# Altium schematic sheet Microcontroller.SchDoc
size A4; SheetNumber: 5; SheetTotal: 5
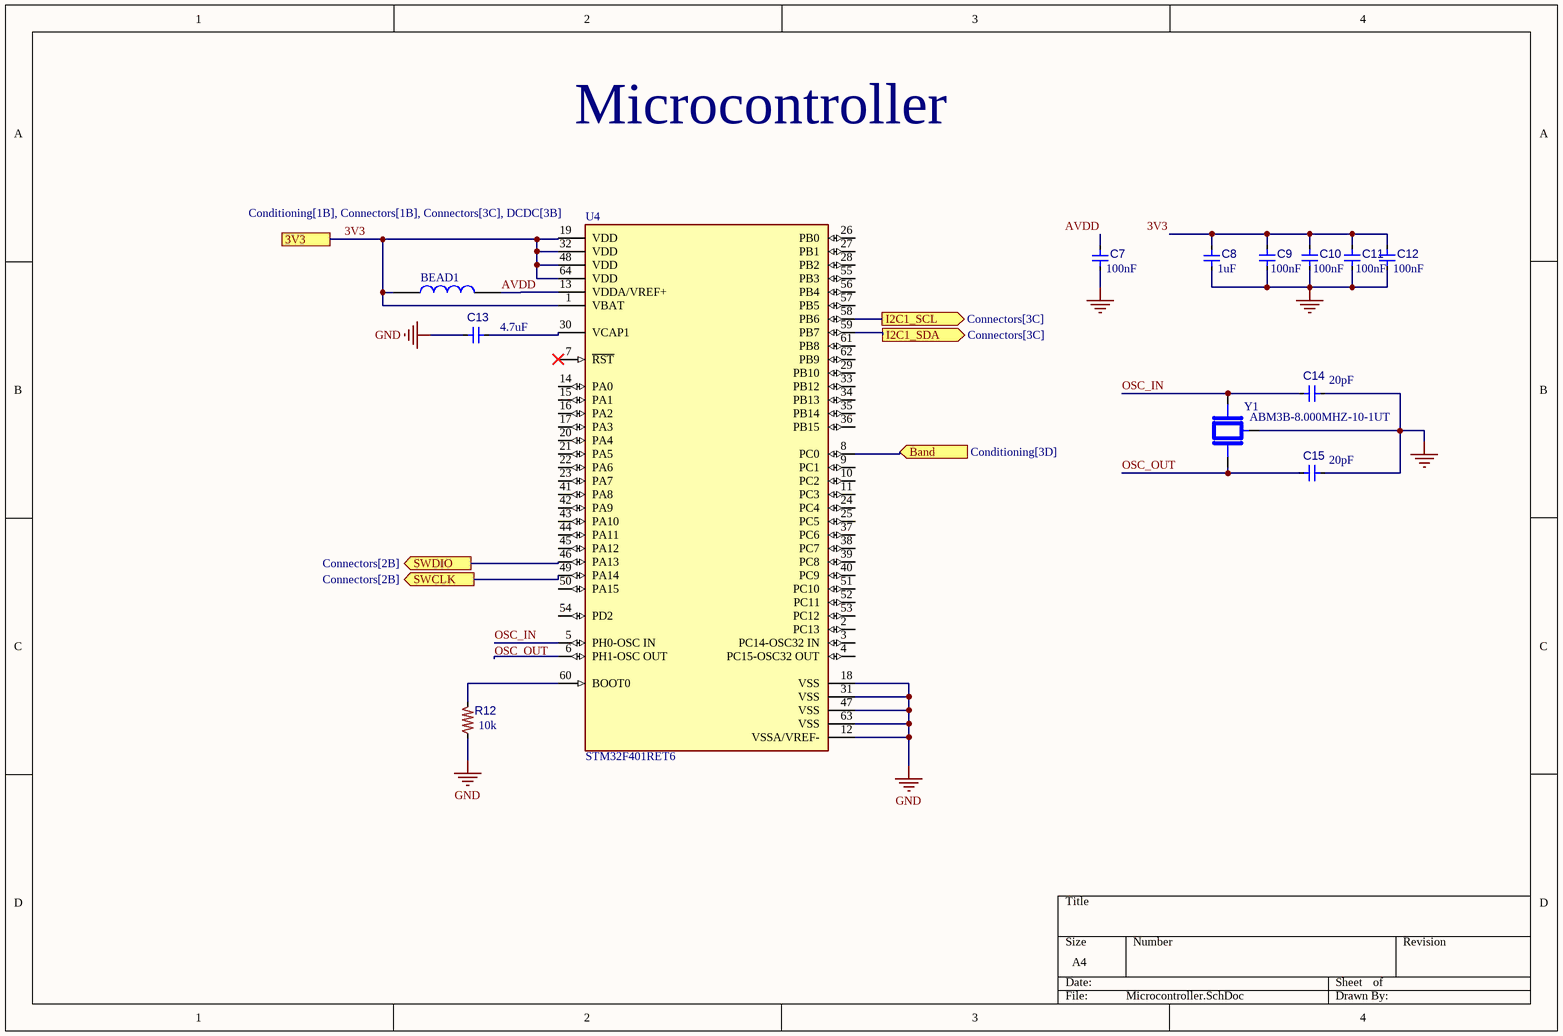
[diagram p0: Microcontroller.SchDoc]

## Parts
BEAD1  C710390  [BEADC1608X95N]  (value not drawn)
C7  C105907  [New footprint 1]  (value not drawn)
C8  C309479  [New footprint 1]  (value not drawn)
C9  C105907  [New footprint 1]  (value not drawn)
C10  C105907  [New footprint 1]  (value not drawn)
C11  C105907  [New footprint 1]  (value not drawn)
C12  C105907  [New footprint 1]  (value not drawn)
C13  C77045  [New footprint 1]  (value not drawn)
C14  C63680  [New footprint 1]  (value not drawn)
C15  C63680  [New footprint 1]  (value not drawn)
R12  C103210  [0603 resistor-Footprint-1]  (value not drawn)
U4  STM32F401RET6  [FP-LQFP64-5W-MFG]
Y1  ABM3B-8.000MHZ-10-1UT  [XTAL_ABM3B-8.000MHZ-10-1UT]

## Ports
3V3 (see Conditioning[1B], Connectors[1B], Connectors[3C], DCDC[3B]), Band (in, see Conditioning[3D]), I2C1_SCL (out, see Connectors[3C]), I2C1_SDA (out, see Connectors[3C]), SWCLK (out, see Connectors[2B]), SWDIO (out, see Connectors[2B])

## Nets
GND: C7.1 C8.1 C9.1 C10.1 C13.1 C14.2 C15.2 R12.2 U4.12(VSSA/VREF-) U4.18(VSS) U4.31(VSS) U4.47(VSS) U4.63(VSS) Y1.4
3V3: BEAD1.1 C8.2 C9.2 C10.2 C11.2 C12.2 U4.1(VBAT) U4.19(VDD) U4.32(VDD) U4.48(VDD) U4.64(VDD) ; port 3V3
AVDD: BEAD1.2 C7.2 U4.13(VDDA/VREF+)
Band: U4.8(PC0) ; port Band
I2C1_SCL: U4.58(PB6) ; port I2C1_SCL
I2C1_SDA: U4.59(PB7) ; port I2C1_SDA
OSC_IN: C14.1 U4.5(PH0-OSC_IN) Y1.3
OSC_OUT: C15.1 U4.6(PH1-OSC_OUT) Y1.1
SWCLK: U4.49(PA14) ; port SWCLK
SWDIO: U4.46(PA13) ; port SWDIO
NetC11_1: C11.1 C12.1
NetC13_2: C13.2 U4.30(VCAP1)
NetR12_1: R12.1 U4.60(BOOT0)

Not connected (* = marked no-connect by the designer): U4 2(PC13) 3(PC14-OSC32_IN) 4(PC15-OSC32_OUT) 7(~{RST})* 9(PC1) 10(PC2) 11(PC3) 14(PA0) 15(PA1) 16(PA2) 17(PA3) 20(PA4) 21(PA5) 22(PA6) 23(PA7) 24(PC4) 25(PC5) 26(PB0) 27(PB1) 28(PB2) 29(PB10) 33(PB12) 34(PB13) 35(PB14) 36(PB15) 37(PC6) 38(PC7) 39(PC8) 40(PC9) 41(PA8) 42(PA9) 43(PA10) 44(PA11) 45(PA12) 50(PA15) 51(PC10) 52(PC11) 53(PC12) 54(PD2) 55(PB3) 56(PB4) 57(PB5) 61(PB8) 62(PB9)

## Notes on the sheet
- Microcontroller
- (near C7) 100nF
- (near C8) 1uF
- (near C9) 100nF
- (near C10) 100nF
- 100nF
- (near C12) 100nF
- (near C13) 4.7uF
- (near C14) 20pF
- (near C15) 20pF
- (near R12) 10k

## Library data of the parts
BEAD1 = CMP-038-000000-3: MURATA Ferrite Beads 120 OHM - BLM18SG121TZ1D; Manufacturer_Name: Walsin Technology Corporation; Geometry.Height: 0.95mm; Mouser Price/Stock: https://www.mouser.co.uk/ProductDetail/Walsin/WLBD1608K1U601TB/?qs=ZrPdAQfJ6DPLMgkQk27DNg%3D%3D; Mouser Part Number: 791-WLBD1608K1U601TB; Design Item ID: WLBD1608K1U601TB; Datasheet Link: https://www.mouser.fr/datasheet/2/210/kamaya_watc-s-a0003407801-1-1749693.pdf; Source: WLBD1608K1U601TB.SchLib; Manufacturer_Part_Number: WLBD1608K1U601TB
C7 C9-C12 = CMP-001-00083-1: 100V 100nF X7R ±10% 0603  Multilayer Ceramic Capacitors MLCC - SMD/SMT ROHS
C8 = CMP-001-00083-1: 6.3V 1uF X7R ±10% 0603  Multilayer Ceramic Capacitors MLCC - SMD/SMT ROHS
C13 = CMP-001-00083-1: 116V 4.7uF X5R ±10% 0603 Multilayer Ceramic Capacitors MLCC - SMD/SMT ROHS
C14 C15 = CMP-001-00083-1: 200V 20pF C0G ±5% 0603 Multilayer Ceramic Capacitors MLCC - SMD/SMT ROHS
R12 = CMP-009-00177-1: 100mW Thick Film Resistors ±100ppm/℃ ±5% 10kΩ 0603 Chip Resistor - Surface Mount ROHS
U4 = CMP-12105-000004-1: 512KB 1.7V~3.6V ARM Cortex-M4 84MHz 50 LQFP-64(10x10)  Microcontroller Units (MCUs/MPUs/SOCs) ROHS; Manufacturer: STMicroelectronics; Memory Size: 512KBytes; Number Of Cores: 1; Max Junction Temp: +105°C; Ram Size: 96KBytes; Number Of Adc Channels: 12; Number Of Pwm Channels: 23; Standoff Height: 0.05mm; Number Of Timers/Counters: 8; Number Of I/Os: 50; Interface: I2C,SPI,USART,USB,IrDA,I2S,SMBus,Other; Number Of I2C Channels: 3; Max Supply Voltage: 3.6V; Data Bus Width: 32bits; Min Supply Voltage: 1.65V; Memory Type: FLASH; Category: IC; Device Class L3: Microcontrollers; ComponentLink2URL: https://www.st.com/resource/en/datasheet/stm32f401re.pdf; RoHS: TRUE; Temperature Range High: +105°C; Device Class L2: Embedded Processors and Controllers; ComponentLink2Description: Datasheet; Temperature Range Low: -40°C; Digikey Description: IC MCU 32BIT 512KB FLASH 64LQFP; Package: LQFP64-5W; Manufacturer Part Number: STM32F401RET6; Number Of A/D Converters: 1; Frequency: 84MHz; Ipc Land Pattern Name: QFP50P1200X1200X160-64; Automotive: No; Ambient Temperature Range Low: -40°C; Height: 1.6mm; Octopart: https://octopart.com/stm32f401ret6-stmicroelectronics-34185993; Ambient Temperature Range High: +85°C; Device Class L1: Integrated Circuits (ICs); Temperature: -40°C to +105°C; Core Architecture: ARM Cortex-M4; Number Of Spi Channels: 3; Number Of Uart Channels: 3; Number Of Usb Channels: 1; Lead Free: Yes; Mouser Description: ARM Microcontrollers - MCU 16/32-BITS MICROS
Y1 = CMP-003-00030-1: Crystal 8MHz Â±10ppm (Tol) Â±10ppm (Stability) 10pF FUND 200Ohm 4-Pin CSMD T/R; MF: Abracon Corporation; Check_prices: https://www.snapeda.com/parts/ABM3B-8.000MHZ-10-1UT/Abracon/view-part/?ref=eda; Availability: In Stock; Component Type: Standard; Source: ABM3B-8.000MHZ-10-1UT.SchLib; Case/Package: Package; Purchase-URL: https://pricing.snapeda.com/search/part/ABM3B-8.000MHZ-10-1UT/?ref=eda; Value: *; MP: ABM3B-8.000MHZ-10-1UT; Price: None; Design Item ID: ABM3B-8.000MHZ-10-1UT; SnapEDA_Link: https://www.snapeda.com/parts/ABM3B-8.000MHZ-10-1UT/Abracon/view-part/?ref=snap; Pins: 4